# Altium schematic sheet BlokDiyagram.SchDoc
size A3; SheetNumber: 1; SheetTotal: 1
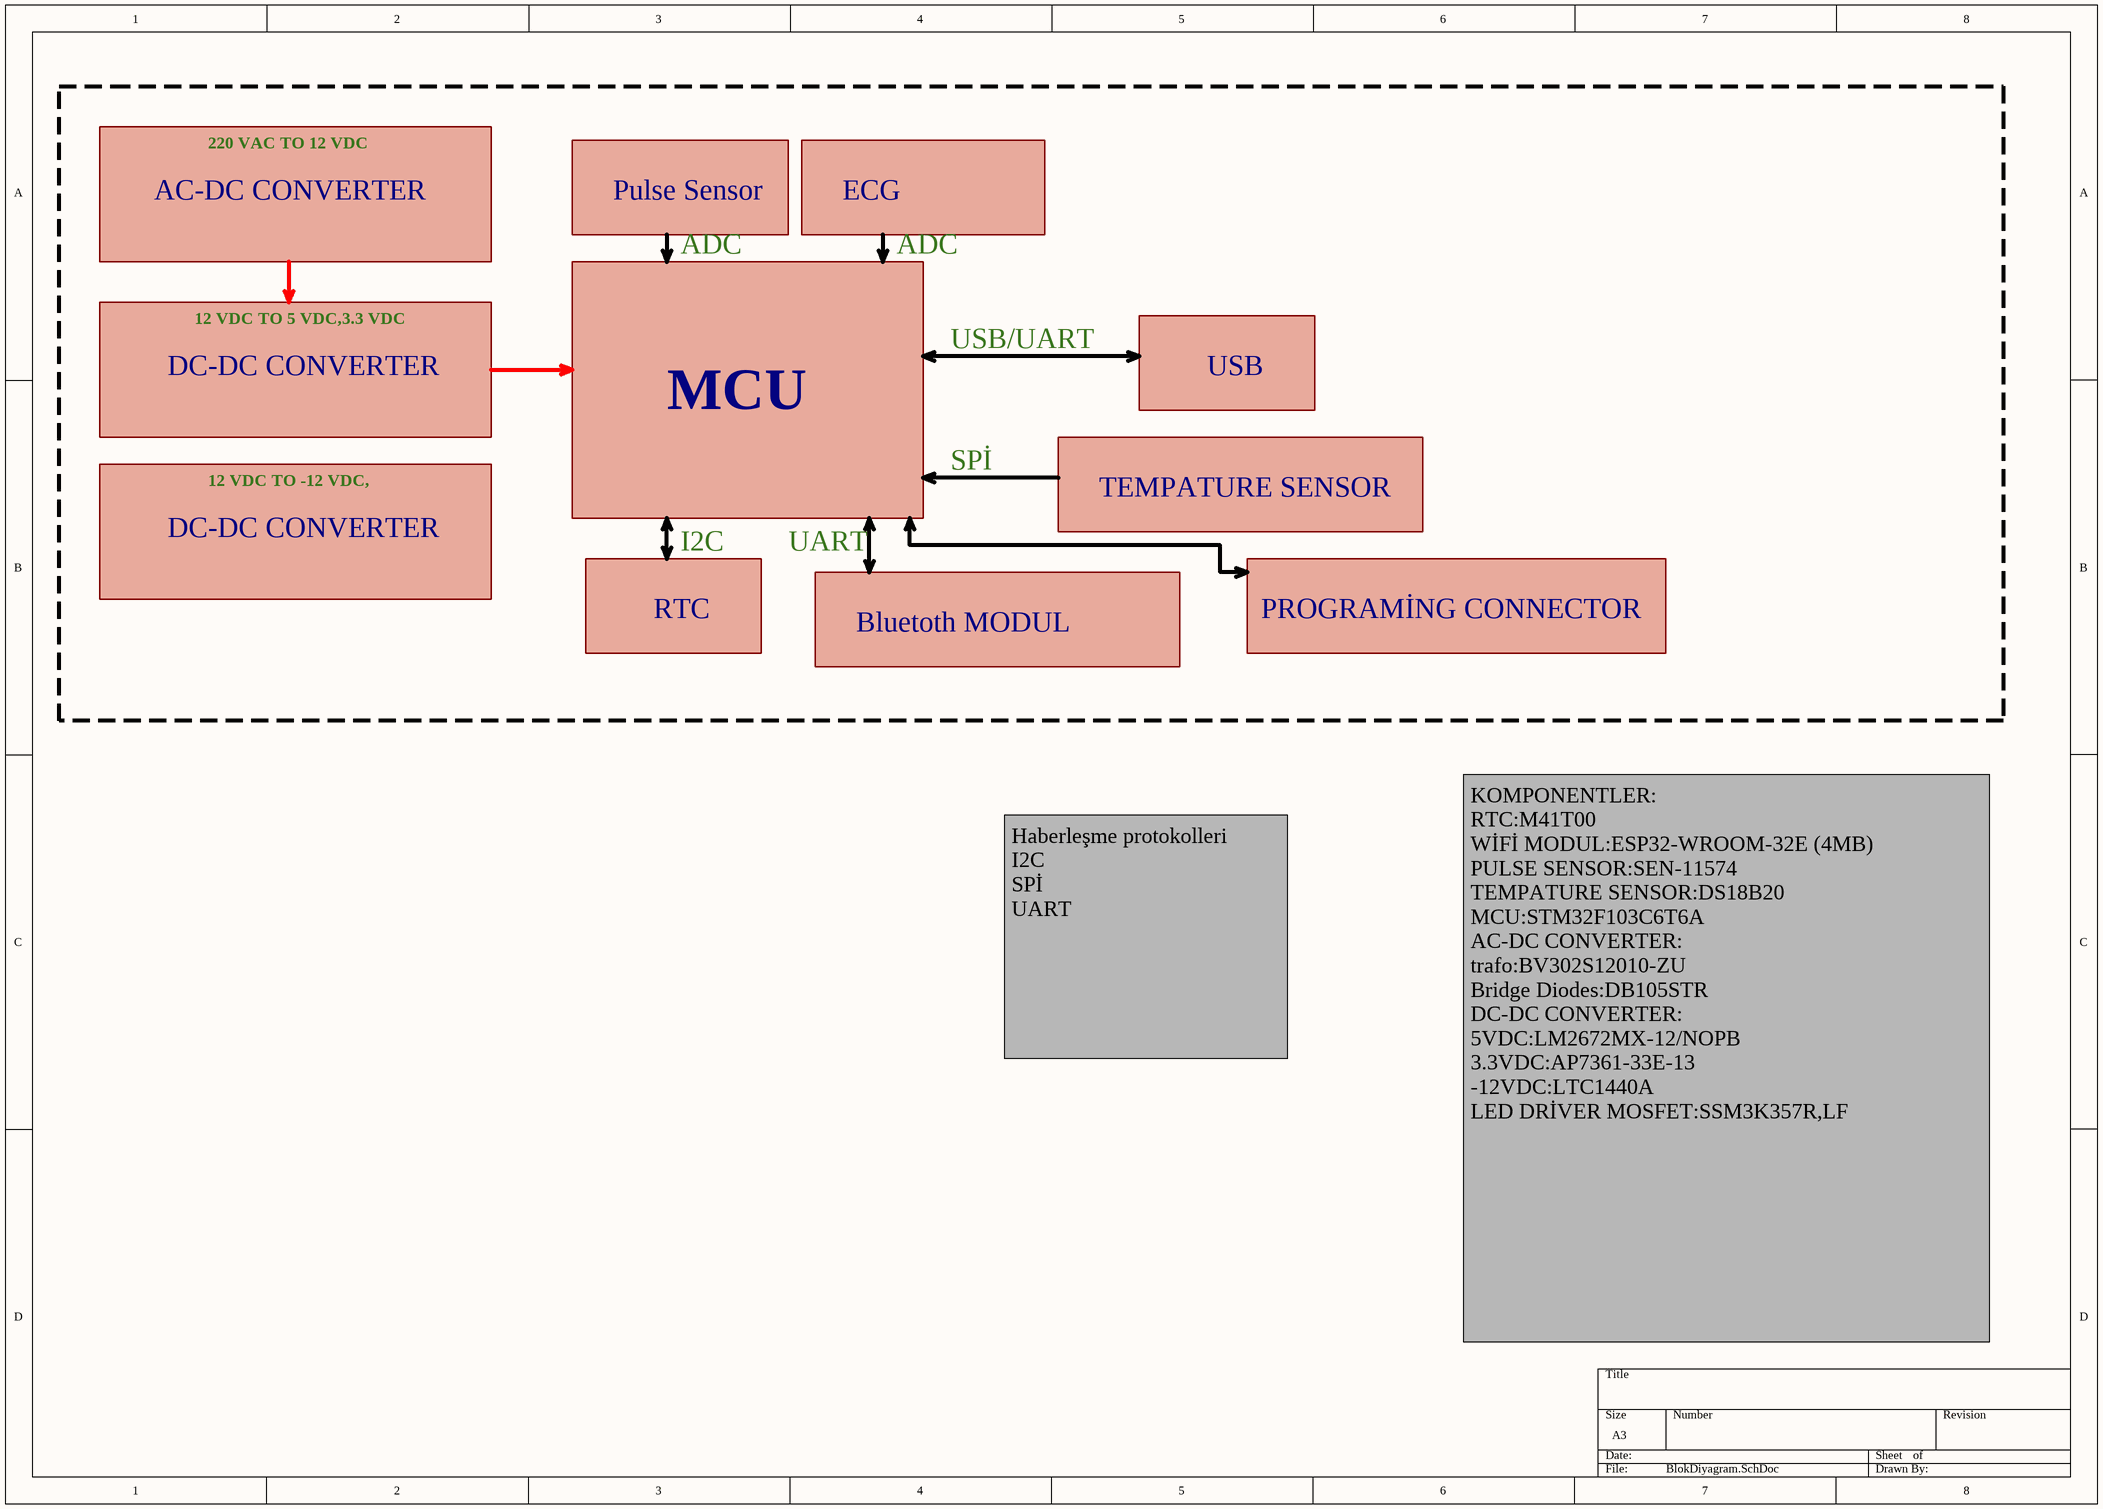
[diagram p0: BlokDiyagram.SchDoc]

## Notes on the sheet
- 220 VAC TO 12 VDC
- AC-DC CONVERTER
- Pulse Sensor
- ECG
- ADC
- DC-DC CONVERTER
- 12 VDC TO 5 VDC,3.3 VDC
- USB/UART
- USB
- MCU
- 12 VDC TO -12 VDC,
- SPİ
- TEMPATURE SENSOR
- I2C
- UART
- RTC
- Bluetoth MODUL
- PROGRAMİNG CONNECTOR
- Haberleşme protokolleri
  I2C
  SPİ
  UART
- KOMPONENTLER:
  RTC:M41T00
  WİFİ MODUL:ESP32-WROOM-32E (4MB)
  PULSE SENSOR:SEN-11574
  TEMPATURE SENSOR:DS18B20
  MCU:STM32F103C6T6A
  AC-DC CONVERTER:
  trafo:BV302S12010-ZU
  Bridge Diodes:DB105STR
  DC-DC CONVERTER:
  5VDC:LM2672MX-12/NOPB
  3.3VDC:AP7361-33E-13
  -12VDC:LTC1440A
  LED DRİVER MOSFET:SSM3K357R,LF